# Altium schematic sheet DMX_8.schdoc
size 309 x 203 mm
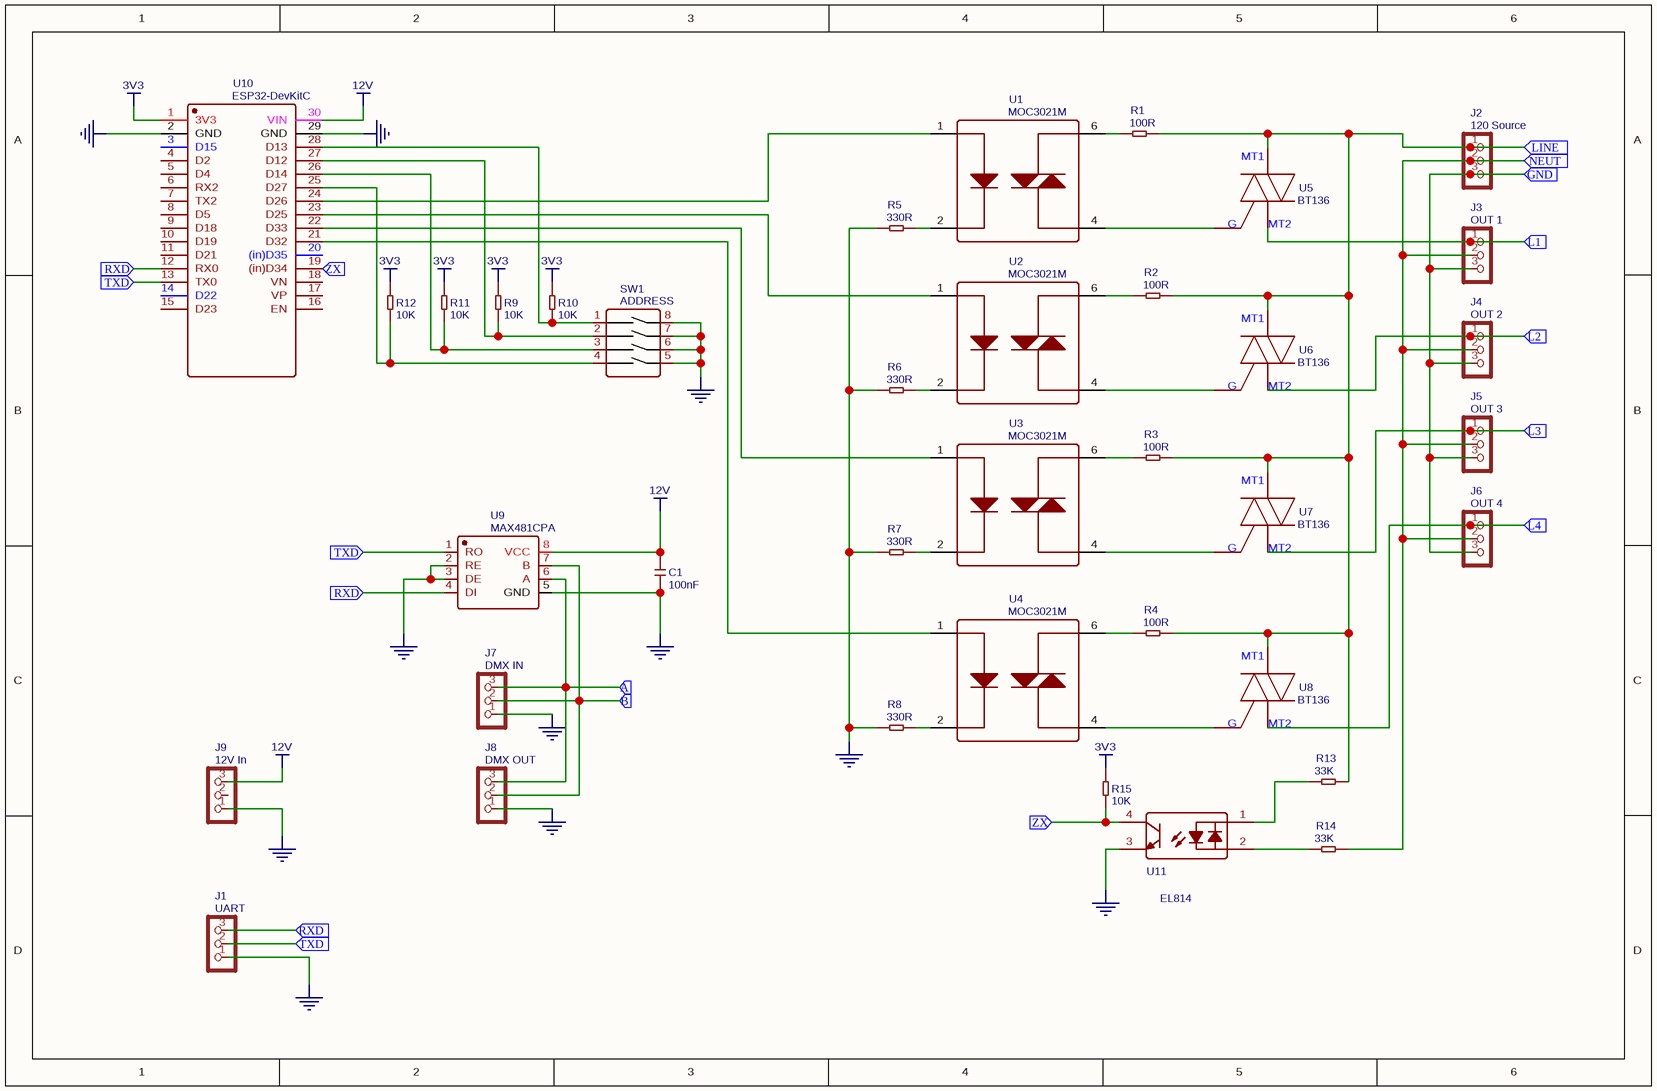
[diagram p0: DMX_8.schdoc]

## Parts
C1  value 100nF  [CERAMIC-2.54]
J1  value UART  [TERMINAL_BLOCK_3P_5]
J2  value 120 Source  [TERMINAL_BLOCK_3P_5]
J3  value OUT 1  [TERMINAL_BLOCK_3P_5]
J4  value OUT 2  [TERMINAL_BLOCK_3P_5]
J5  value OUT 3  [TERMINAL_BLOCK_3P_5]
J6  value OUT 4  [TERMINAL_BLOCK_3P_5]
J7  value DMX IN  [TERMINAL_BLOCK_3P_5]
J8  value DMX OUT  [TERMINAL_BLOCK_3P_5]
J9  value 12V In  [TERMINAL_BLOCK_3P_5]
R1  value 100R  [PR-D2.3XL6.5MM]
R2  value 100R  [PR-D2.3XL6.5MM]
R3  value 100R  [PR-D2.3XL6.5MM]
R4  value 100R  [PR-D2.3XL6.5MM]
R5  value 330R  [PR-D2.3XL6.5MM]
R6  value 330R  [PR-D2.3XL6.5MM]
R7  value 330R  [PR-D2.3XL6.5MM]
R8  value 330R  [PR-D2.3XL6.5MM]
R9  value 10K  [PR-D2.3XL6.5MM]
R10  value 10K  [PR-D2.3XL6.5MM]
R11  value 10K  [PR-D2.3XL6.5MM]
R12  value 10K  [PR-D2.3XL6.5MM]
R13  value 33K  [PR-D2.3XL6.5MM]
R14  value 33K  [PR-D2.3XL6.5MM]
R15  value 10K  [PR-D2.3XL6.5MM]
SW1  value ADDRESS  [DIP switchEI-04]
U1  value MOC3021M  [DIP-6_300MIL]
U2  value MOC3021M  [DIP-6_300MIL]
U3  value MOC3021M  [DIP-6_300MIL]
U4  value MOC3021M  [DIP-6_300MIL]
U5  value BT136  [TO220]
U6  value BT136  [TO220]
U7  value BT136  [TO220]
U8  value BT136  [TO220]
U9  value MAX481CPA  [DIP8]
U10  value ESP32-DevKitC  [ESP32 DOIT DEVKIT V1]
U11  value EL814  [DIP-4]

## Ports
A, B, GND, L1, L2, L3, L4, LINE, NEUT, RXD, TXD, ZX

## Nets
3V3: R9.2 R10.2 R11.2 R12.2 R15.2 U10.1(3V3)
12V: C1.2 J9.3 U9.8(VCC) U10.30(VIN)
GND: C1.1 J1.1 J7.1 J8.1 J9.1 R5.1 R6.1 R7.1 R8.1 SW1.5 SW1.6 SW1.7 SW1.8 U9.2(RE) U9.3(DE) U9.5(GND) U10.2(GND) U10.29(GND) U11.3
A: J7.3 J8.3 U9.6(A) ; port A
B: J7.2 J8.2 U9.7(B) ; port B
GND: J2.3 J3.3 J4.3 J5.3 J6.3 ; port GND  [a separate net that carries the same name]
L1: J3.1 U5.2(MT2) ; port L1
L2: J4.1 U6.2(MT2) ; port L2
L3: J5.1 U7.2(MT2) ; port L3
L4: J6.1 U8.2(MT2) ; port L4
LINE: J2.1 R1.2 R2.2 R3.2 R4.2 R13.1 U5.1(MT1) U6.1(MT1) U7.1(MT1) U8.1(MT1) ; port LINE
NEUT: J2.2 J3.2 J4.2 J5.2 J6.2 R14.1 ; port NEUT
RXD: J1.3 U9.4(DI) U10.12(RX0) ; port RXD
TXD: J1.2 U9.1(RO) U10.13(TX0) ; port TXD
ZX: R15.1 U10.19((in)D34) U11.4 ; port ZX
NetR1_1: R1.1 U1.6
NetR2_1: R2.1 U2.6
NetR3_1: R3.1 U3.6
NetR4_1: R4.1 U4.6
NetR5_2: R5.2 U1.2
NetR6_2: R6.2 U2.2
NetR7_2: R7.2 U3.2
NetR8_2: R8.2 U4.2
NetR9_1: R9.1 SW1.2 U10.27(D12)
NetR10_1: R10.1 SW1.1 U10.28(D13)
NetR11_1: R11.1 SW1.3 U10.26(D14)
NetR12_1: R12.1 SW1.4 U10.25(D27)
NetR13_2: R13.2 U11.1
NetR14_2: R14.2 U11.2
NetU1_1: U1.1 U10.24(D26)
NetU1_4: U1.4 U5.3(G)
NetU2_1: U2.1 U10.23(D25)
NetU2_4: U2.4 U6.3(G)
NetU3_1: U3.1 U10.22(D33)
NetU3_4: U3.4 U7.3(G)
NetU4_1: U4.1 U10.21(D32)
NetU4_4: U4.4 U8.3(G)

Not connected (* = marked no-connect by the designer): J9 2; U10 3(D15) 4(D2) 5(D4) 6(RX2) 7(TX2) 8(D5) 9(D18) 10(D19) 11(D21) 14(D22) 15(D23) 16(EN) 17(VP) 18(VN) 20((in)D35)

## Library data of the parts
C1 = (no symbol name): BOM_Manufacturer Part: CC1-F5SL2A101KSPW; catid: 20; description: DIP CAP Ceramic Disc 100nF-50V-Y5V; spicePre: C
J1-J9 = (no symbol name): catid: 20; Contributor: DangerousPrototype; BOM_Manufacturer Part: ?; spicePre: J
R1-R15 = (no symbol name): BOM_Manufacturer Part: FHCFR-1/4W-101J; catid: 20; description: DIP RES 100R-5%-1/4W; spicePre: R
SW1 = (no symbol name): BOM_Manufacturer: DIP; BOM_Supplier: LCSC; BOM_Manufacturer Part: DIP switchEI-04; BOM_LCSC: C99987; spicePre: S
U1-U4 = (no symbol name): BOM_Manufacturer: FAIRCHILD; BOM_Supplier: LCSC; BOM_Manufacturer Part: MOC3021M; BOM_LCSC: C5242; spicePre: U
U5-U8 = (no symbol name): nameAlias: Model; catid: 20; Contributor: cmccooke; spicePre: X; BOM_Manufacturer Part: ?; spiceSymbolName: BT136
U11 = (no symbol name): BOM_Manufacturer: EVERLIGHT; BOM_Supplier: LCSC; BOM_Manufacturer Part: EL814; BOM_LCSC: C71046; spicePre: U
U9 U10 = (no symbol name): spicePre: X; BOM_Manufacturer Part: ?